# Altium schematic sheet Top_Sheet.SchDoc
size 420 x 297 mm; SheetNumber: 1; SheetTotal: 11
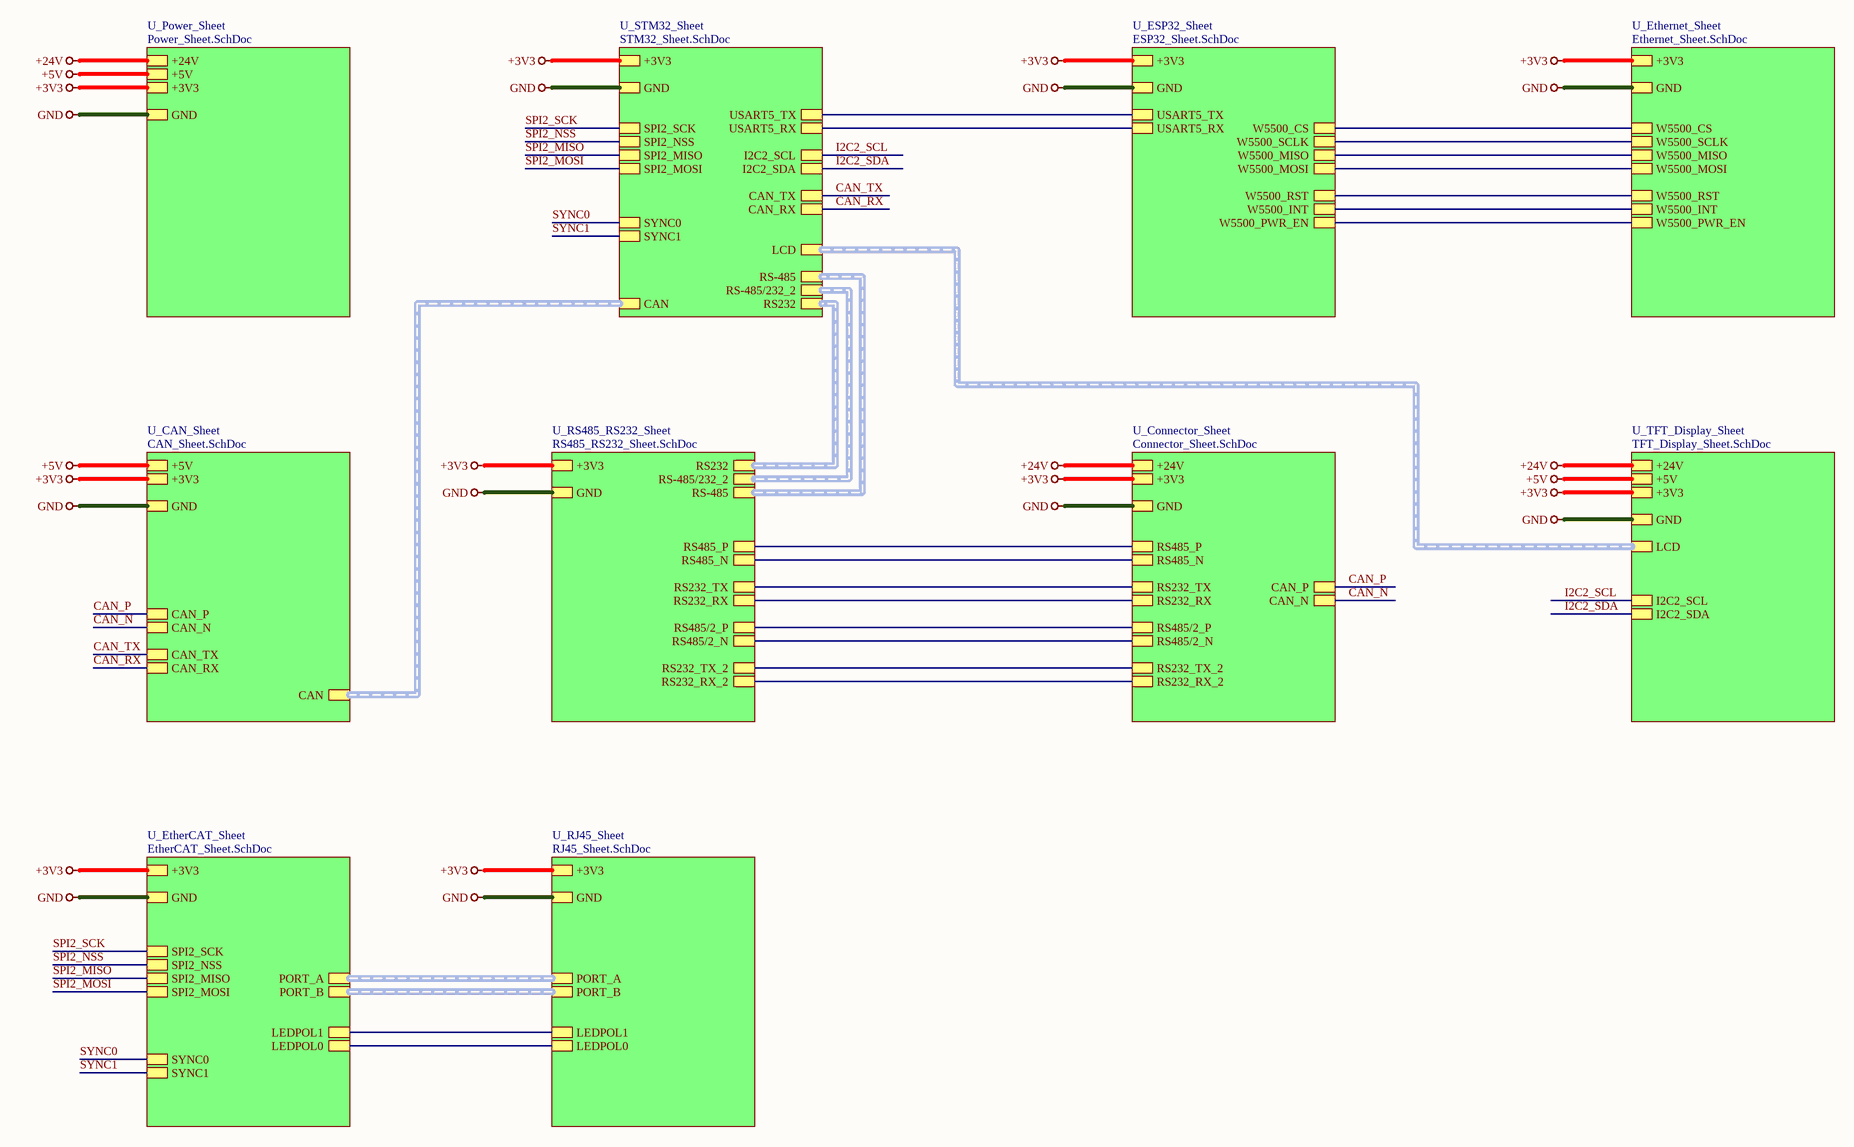
[diagram p0: Top_Sheet.SchDoc]

## Sub-sheets
U_CAN_Sheet = CAN_Sheet.SchDoc: CAN (harness CAN), CAN_RX, CAN_TX, CAN_P, CAN_N, +5V, +3V3, GND
U_Connector_Sheet = Connector_Sheet.SchDoc: RS485/2_N, RS485/2_P, RS232_RX_2, RS232_TX_2, RS485_N, RS485_P, RS232_RX, RS232_TX, CAN_P, CAN_N, +3V3, GND, +24V
U_ESP32_Sheet = ESP32_Sheet.SchDoc: +3V3, GND, W5500_SCLK, W5500_MISO, W5500_MOSI, W5500_RST, W5500_INT, W5500_CS, W5500_PWR_EN, USART5_TX, USART5_RX
U_EtherCAT_Sheet = EtherCAT_Sheet.SchDoc: PORT_A (harness PORT_A), PORT_B (harness PORT_B), LEDPOL0, LEDPOL1, SPI2_SCK, SPI2_NSS, SPI2_MISO, SPI2_MOSI, +3V3, GND, SYNC1, SYNC0
U_Ethernet_Sheet = Ethernet_Sheet.SchDoc: W5500_SCLK, W5500_MISO, W5500_MOSI, W5500_RST, W5500_INT, W5500_CS, W5500_PWR_EN, +3V3, GND
U_Power_Sheet = Power_Sheet.SchDoc: +24V, +5V, +3V3, GND
U_RJ45_Sheet = RJ45_Sheet.SchDoc: PORT_A (harness PORT_A), PORT_B (harness PORT_B), LEDPOL0, LEDPOL1, +3V3, GND
U_RS485_RS232_Sheet = RS485_RS232_Sheet.SchDoc: RS485_N, RS485_P, RS232_RX, RS232_TX, RS-485 (harness RS-485), +3V3, GND, RS485/2_N, RS485/2_P, RS232_RX_2, RS232_TX_2, RS-485/232_2 (harness RS-485/232_2), RS232 (harness RS232)
U_STM32_Sheet = STM32_Sheet.SchDoc: SPI2_SCK, SPI2_NSS, SPI2_MISO, SPI2_MOSI, RS-485/232_2 (harness RS-485/232_2), RS232 (harness RS232), +3V3, GND, USART5_TX, USART5_RX, RS-485 (harness RS-485), CAN_RX, CAN_TX, CAN (harness CAN), LCD (harness TFT_LCD), I2C2_SCL, I2C2_SDA, SYNC1, SYNC0
U_TFT_Display_Sheet = TFT_Display_Sheet.SchDoc: +3V3, GND, LCD (harness TFT_LCD), +24V, I2C2_SCL, I2C2_SDA, +5V

## Nets
+3V3: sheet U_CAN_Sheet/+3V3, sheet U_Connector_Sheet/+3V3, sheet U_ESP32_Sheet/+3V3, sheet U_EtherCAT_Sheet/+3V3, sheet U_Ethernet_Sheet/+3V3, sheet U_Power_Sheet/+3V3, sheet U_RJ45_Sheet/+3V3, sheet U_RS485_RS232_Sheet/+3V3, sheet U_STM32_Sheet/+3V3, sheet U_TFT_Display_Sheet/+3V3
+5V: sheet U_CAN_Sheet/+5V, sheet U_Power_Sheet/+5V, sheet U_TFT_Display_Sheet/+5V
+24V: sheet U_Connector_Sheet/+24V, sheet U_Power_Sheet/+24V, sheet U_TFT_Display_Sheet/+24V
GND: sheet U_CAN_Sheet/GND, sheet U_Connector_Sheet/GND, sheet U_ESP32_Sheet/GND, sheet U_EtherCAT_Sheet/GND, sheet U_Ethernet_Sheet/GND, sheet U_Power_Sheet/GND, sheet U_RJ45_Sheet/GND, sheet U_RS485_RS232_Sheet/GND, sheet U_STM32_Sheet/GND, sheet U_TFT_Display_Sheet/GND
CAN_N: sheet U_CAN_Sheet/CAN_N, sheet U_Connector_Sheet/CAN_N
CAN_P: sheet U_CAN_Sheet/CAN_P, sheet U_Connector_Sheet/CAN_P
CAN_RX: sheet U_CAN_Sheet/CAN_RX, sheet U_STM32_Sheet/CAN_RX
CAN_TX: sheet U_CAN_Sheet/CAN_TX, sheet U_STM32_Sheet/CAN_TX
I2C2_SCL: sheet U_STM32_Sheet/I2C2_SCL, sheet U_TFT_Display_Sheet/I2C2_SCL
I2C2_SDA: sheet U_STM32_Sheet/I2C2_SDA, sheet U_TFT_Display_Sheet/I2C2_SDA
SPI2_MISO: sheet U_EtherCAT_Sheet/SPI2_MISO, sheet U_STM32_Sheet/SPI2_MISO
SPI2_MOSI: sheet U_EtherCAT_Sheet/SPI2_MOSI, sheet U_STM32_Sheet/SPI2_MOSI
SPI2_NSS: sheet U_EtherCAT_Sheet/SPI2_NSS, sheet U_STM32_Sheet/SPI2_NSS
SPI2_SCK: sheet U_EtherCAT_Sheet/SPI2_SCK, sheet U_STM32_Sheet/SPI2_SCK
SYNC0: sheet U_EtherCAT_Sheet/SYNC0, sheet U_STM32_Sheet/SYNC0
SYNC1: sheet U_EtherCAT_Sheet/SYNC1, sheet U_STM32_Sheet/SYNC1
(unnamed): sheet U_Connector_Sheet/RS485/2_N, sheet U_RS485_RS232_Sheet/RS485/2_N
(unnamed): sheet U_Connector_Sheet/RS485/2_P, sheet U_RS485_RS232_Sheet/RS485/2_P
(unnamed): sheet U_Connector_Sheet/RS232_RX_2, sheet U_RS485_RS232_Sheet/RS232_RX_2
(unnamed): sheet U_Connector_Sheet/RS232_TX_2, sheet U_RS485_RS232_Sheet/RS232_TX_2
(unnamed): sheet U_Connector_Sheet/RS485_N, sheet U_RS485_RS232_Sheet/RS485_N
(unnamed): sheet U_Connector_Sheet/RS485_P, sheet U_RS485_RS232_Sheet/RS485_P
(unnamed): sheet U_Connector_Sheet/RS232_RX, sheet U_RS485_RS232_Sheet/RS232_RX
(unnamed): sheet U_Connector_Sheet/RS232_TX, sheet U_RS485_RS232_Sheet/RS232_TX
(unnamed): sheet U_ESP32_Sheet/W5500_SCLK, sheet U_Ethernet_Sheet/W5500_SCLK
(unnamed): sheet U_ESP32_Sheet/W5500_MISO, sheet U_Ethernet_Sheet/W5500_MISO
(unnamed): sheet U_ESP32_Sheet/W5500_MOSI, sheet U_Ethernet_Sheet/W5500_MOSI
(unnamed): sheet U_ESP32_Sheet/W5500_RST, sheet U_Ethernet_Sheet/W5500_RST
(unnamed): sheet U_ESP32_Sheet/W5500_INT, sheet U_Ethernet_Sheet/W5500_INT
(unnamed): sheet U_ESP32_Sheet/W5500_CS, sheet U_Ethernet_Sheet/W5500_CS
(unnamed): sheet U_ESP32_Sheet/W5500_PWR_EN, sheet U_Ethernet_Sheet/W5500_PWR_EN
(unnamed): sheet U_ESP32_Sheet/USART5_TX, sheet U_STM32_Sheet/USART5_TX
(unnamed): sheet U_ESP32_Sheet/USART5_RX, sheet U_STM32_Sheet/USART5_RX
(unnamed): sheet U_EtherCAT_Sheet/LEDPOL0, sheet U_RJ45_Sheet/LEDPOL0
(unnamed): sheet U_EtherCAT_Sheet/LEDPOL1, sheet U_RJ45_Sheet/LEDPOL1

## Buses and harness runs
harness sheet U_CAN_Sheet/CAN = sheet U_STM32_Sheet/CAN
harness sheet U_EtherCAT_Sheet/PORT_A = sheet U_RJ45_Sheet/PORT_A
harness sheet U_EtherCAT_Sheet/PORT_B = sheet U_RJ45_Sheet/PORT_B
harness sheet U_RS485_RS232_Sheet/RS232 = sheet U_STM32_Sheet/RS232
harness sheet U_RS485_RS232_Sheet/RS-485 = sheet U_STM32_Sheet/RS-485
harness sheet U_RS485_RS232_Sheet/RS-485/232_2 = sheet U_STM32_Sheet/RS-485/232_2
harness sheet U_STM32_Sheet/LCD = sheet U_TFT_Display_Sheet/LCD

## Notes on the sheet
- File:
- Title:
- Date:
- Page
- Num:
- Total:
- Drawn By: Huzaifa Ali